# Altium schematic sheet [2]- Connector_Page.SchDoc: STM Bluepill
size A; DrawnBy: Aviral Mishra; DocumentNumber: 2; Revision: V1.0; SheetNumber: 2; SheetTotal: 2; Company Name: Esteem PCB
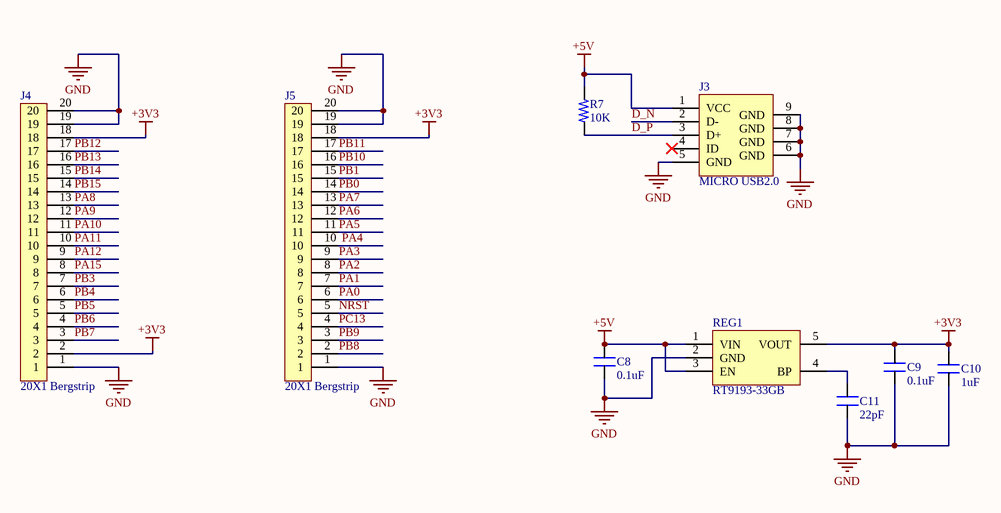
[diagram p0: [2]- Connector_Page.SchDoc]

## Parts
C8  0.1uF  [CAP_0805]
C9  0.1uF  [CAP_0805]
C10  1uF  [CAP_0805]
C11  22pF  [CAP_0805]
J3  MICRO USB2.0  [CON_10118192-0001LF_SMD]
J4  20X1 Bergstrip  [CON20_100_40D72_TH_ST]
J5  20X1 Bergstrip  [CON20_100_40D72_TH_ST]
R7  10K  [RES_0805]
REG1  RT9193-33GB  [SOT23-5]

## Nets
+3V3: C9.2 C10.2 J4.2 J4.18 J5.18 REG1.5(VOUT)
+5V: C8.2 J3.1(VCC) R7.2 REG1.1(VIN) REG1.3(EN)
GND: C8.1 C9.1 C10.1 C11.1 J3.5(GND) J3.6(GND) J3.7(GND) J3.8(GND) J3.9(GND) J4.1 J4.19 J4.20 J5.1 J5.19 J5.20 REG1.2(GND)
D_N: J3.2(D-)
D_P: J3.3(D+) R7.1
NRST: J5.5
PA0: J5.6
PA1: J5.7
PA2: J5.8
PA3: J5.9
PA4: J5.10
PA5: J5.11
PA6: J5.12
PA7: J5.13
PA8: J4.13
PA9: J4.12
PA10: J4.11
PA11: J4.10
PA12: J4.9
PA15: J4.8
PB0: J5.14
PB1: J5.15
PB3: J4.7
PB4: J4.6
PB5: J4.5
PB6: J4.4
PB7: J4.3
PB8: J5.2
PB9: J5.3
PB10: J5.16
PB11: J5.17
PB12: J4.17
PB13: J4.16
PB14: J4.15
PB15: J4.14
PC13: J5.4
NetC11_2: C11.2 REG1.4(BP)

Not connected (* = marked no-connect by the designer): J3 4(ID)*

## Notes on the sheet
- Company Name

## Library data of the parts
C8 C9 = CAP_0.1uF-50V-5%-0805: 0.1µF ±5% 50V Ceramic Capacitor X7R 0805 (2012 Metric); Manufacturer: KEMET; Manufacturing Part Number: C0805C104J5RACTU; Case/Package: 0805 (2012 Metric); Supplier-1: Digikey; Supplier Part Number-1: 399-1171-1-ND
C10 = CAP_1uF-50V-5%-0805: 1µF ±5% 50V Ceramic Capacitor X7R 0805 (2012 Metric); Manufacturer: Yageo; Manufacturing Part Number: CC0805JKX7R9BB105; Case/Package: 0805 (2012 Metric); Supplier-1: Digikey; Supplier Part Number-1: 311-3498-1-ND
C11 = CAP_22pF-50V-5%-0805: 22pF ±5% 50V Ceramic Capacitor C0G, NP0 0805 (2012 Metric); Manufacturer: KEMET; Manufacturer Part Number: C0805C220J5GACTU; Case/Package: 0805; Supplier-1: Digikey; Supplier Part Number-1: 399-1113-1-ND
J3 = CON-USB_10118192-0002LF-SMD: USB - micro B USB 2.0 Receptacle Connector 5 Position Surface Mount, Right Angle; Manufacturer: Amphenol ICC (FCI); Manufacturing Part Number: 10118192-0002LF; Case/Package: SMD; Supplier-1: Digikey; Supplier Part Number-1: 609-5379-1-ND
J4 J5 = CON-BS-PLG_20X1-100-TH-ST: 20 pin, 1 row, 2.54mm pitch bergstrip; Manufacturer: NA; Manufacturing Part Number: NA; Case/Package: TH; Supplier-1: NA; Supplier Part Number-1: NA
R7 = RES_10K-0.125W-1%-0805: 10 kOhms ±1% 0.125W, 1/8W Chip Resistor 0805 (2012 Metric) Moisture Resistant Thick Film; Manufacturer: Yageo; Manufacturing Part Number: RC0805FR-0710KL; Case/Package: 0805; Supplier-1: Digikey; Supplier Part Number-1: 311-10.0KCRCT-ND
REG1 = REG_3.3V-5.5V-0.3A-SOT-23-5: Linear Voltage Regulator IC 1 Output 300mA SOT-23-5; Manufacturer: Richtek USA Inc.; Manufacturer Part Number: RT9193-33GB; Case/ Package: SOT-23-5; Supplier-1: Digikey; Supplier Part Number-1: 1028-1014-1-ND